# Altium project KP580_Generator.PrjPcb
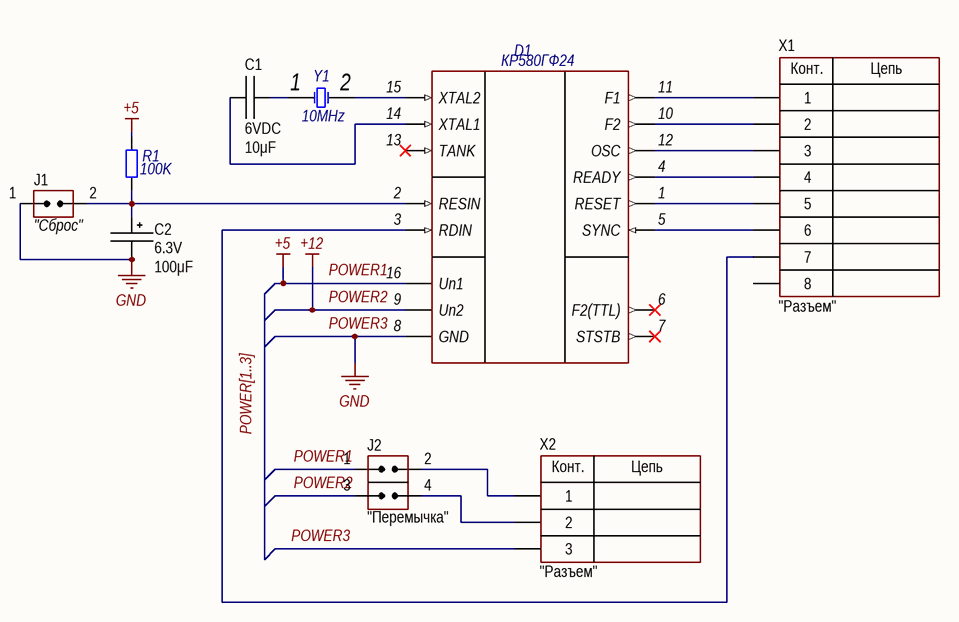
[diagram p0: Schema.SchDoc]
1 sheet, 9 parts. Net scope: global (net labels, ports and power ports of the same name join across sheets).
Board file: PCB1.PcbDoc

## Sheet Schema.SchDoc: =GlobalProjectName
size 209 x 297 mm; ApprovedBy: Утвердил; CheckedBy: Проверил; Author: Разработал; SheetNumber: Лист; SheetTotal: Листов; PageSetup: Record=PageOptions|CenterHorizontal=True|CenterVertical=True|PrintScale=1.00|XCorrection=1.00|YCorrection=1.00|PrintKind=1|BorderSize=5000000|LeftOffset=0|BottomOffset=0|Orientation=2|PaperLength=1000|PaperWidth=1000|Scale=100|PaperSource=15|PrintQuality=1200|MediaType=1|DitherType=10|PaperKind=A3|PrintScaleMode=1; Weight: -; ScaleFactor: -; NormInspection: Норм.Контр.

### Parts
C1  value 10μF  Voltage: 6VDC  [CAP: VY2]
C2  value 100μF  Voltage: 6.3V  [CAP: TANTAL-A]
D1  КР580ГФ24  [DIP16]
J1  CommentText: "Сброс"  [CON: PLS-2]
J2  CommentText: "Перемычка"  [CON: PLD-4]
R1  value 100K  [AXIAL-0.4]  (hidden comment: Res2)
X1  CommentText: "Разъем"  [CON: PLD-8]
X2  CommentText: "Разъем"  [CON: PLS-3]
Y1  10MHz  [R38]

### Nets
+5: D1.16(Uп1) R1.2
+12: D1.9(Uп2)
GND: C2.2 D1.8(GND) J1.1(IN)
NetC1_1: C1.1 Y1.1(OSC1)
NetC1_2: C1.2 D1.14(XTAL1)
NetC2_1: C2.1 D1.2(RESIN) J1.2(IN) R1.1
NetD1_1: D1.1(RESET) X1.5
NetD1_3: D1.3(RDIN) X1.7
NetD1_4: D1.4(READY) X1.4
NetD1_5: D1.5(SYNC) X1.6
NetD1_10: D1.10(F2) X1.2
NetD1_11: D1.11(F1) X1.1
NetD1_12: D1.12(OSC) X1.3
NetD1_15: D1.15(XTAL2) Y1.2(OSC2)
NetJ2_2: J2.2(IN) X2.1
NetJ2_4: J2.4(IN) X2.2

Not connected (* = marked no-connect by the designer): D1 6(F2(TTL))* 7(STSTB)* 13(TANK)*; J2 1(IN) 3(IN); X1 8; X2 3

### Buses and harness runs
bus POWER[1..3]

### Notes on the sheet
- Labels drawn without touching a wire or pin: POWER1, POWER2, POWER3, POWER[1..3]
- Перв. примен.
- Справ. №
- Подп. и дата
- Инв. № дубл.
- Взам. инв. №
- Разраб.
- Изм.
- Лист
- № докум.
- Подп.
- Дата
- Литера
- Масса
- Масштаб
- Пров.
- Т.контр.
- Листов
- Инв. № подл.
- Н.контр.
- Утв.
- Форма 1 ГОСТ 2.104-2006
- Копировал
- Формат А4
- (in symbol PLD-8) Конт.; Цепь
- (in symbol PLS-3) Конт.; Цепь

### Library data of the parts
C1 = Film: Manufacturer: Epcos; PartNumber: B32774D4106K000; ValueManufacturerPartNumber: Film capacitor, 10μF, 6VDC, ±10%, 10.9mOhm, 31.5x15 mm, -40...+105°C; TypeCapacitor: Film capacitor; Tolerance: ±10%; Impedance: 10.9mOhm; Package: 31.5x15 mm; HelpURL: https://www.digikey.com/products/en/capacitors/film-capacitors/62?k=&pkeyword=&sv=0&pv2097=1958&sf=0&FV=fffc01ef%2C1f140000%2Cffe0003e%2Cffec6366&quantity=1&ColumnSort=1000011&page=1&stock=1&pageSize=25; Temperature: -40...+105°C
C2 = Tantal_A: Manufacturer: AVX; PartNumber: F930J107KAAAJ6; ValueManufacturerPartNumber: Tantalum capacitor, 100μF, 6.3V, ±10%, 2Ohm, case A (3216), -55...+125°C; Impedance: 2Ohm; Tolerance: ±10%; TypeDielectric: X7R; TypeCapacitor: Tantalum capacitor; Package: case A (3216); HelpURL: https://www.digikey.com/product-detail/en/avx-corporation/F930J107KAAAJ6/478-12404-1-ND/9645231; Temperature: -55...+125°C
D1 = КР580ГФ24: Генератор тактовых сигналов; Manufacture: Гамма; Case: DIP16; HelpURL: https://www.chipdip.ru/product0/27661; Model: КР580ГФ24
J1 = Jumper_single
J2 = Jumper_double
R1 = Res2: Resistor; Published: 8-Jun-2000; LatestRevisionDate: 17-Jul-2002; LatestRevisionNote: Re-released for DXP Platform.; PackageReference: AXIAL-0.4; Publisher: Altium Limited; PackageDescription: Axial Device, Thru-Hole; 2 Leads; 0.4 in Pin Spacing
X1 = PLD-8: Manufacturer: Connfly; ValueManufacturerPartNumber: Connector, 8pin, 2.54mm, 500VAC, 3A; TypeConnector: Connector; VoltageMax: 500VAC; Pitch: 2.54mm; CurrentMax: 3A; Multichannel: 8pin; HelpURL: https://www.chipdip.ru/product/pld-8-ds1021-2x4; PartNumber: PLD-8
X2 = PLS-3: Manufacturer: Connfly; ValueManufacturerPartNumber: Connector, 3pin, 2.54mm, 500VAC, 3A; TypeConnector: Connector; VoltageMax: 500VAC; Pitch: 2.54mm; CurrentMax: 3A; Multichannel: 3pin; HelpURL: https://www.chipdip.ru/product/pls-3; PartNumber: PLS-3
Y1 = XTAL: Crystal Oscillator; Published: 8-Jun-2000; LatestRevisionDate: 17-Jul-2002; LatestRevisionNote: Re-released for DXP Platform.; PackageReference: R38; Publisher: Altium Limited; PackageDescription: Crystal, Thru-Hole; 2 Leads; Body 3.1 x 8.2 mm (Dia.xH)